# EAGLE design DSO150_Conversion_Board_1.0 (EAGLE 8.6.0)
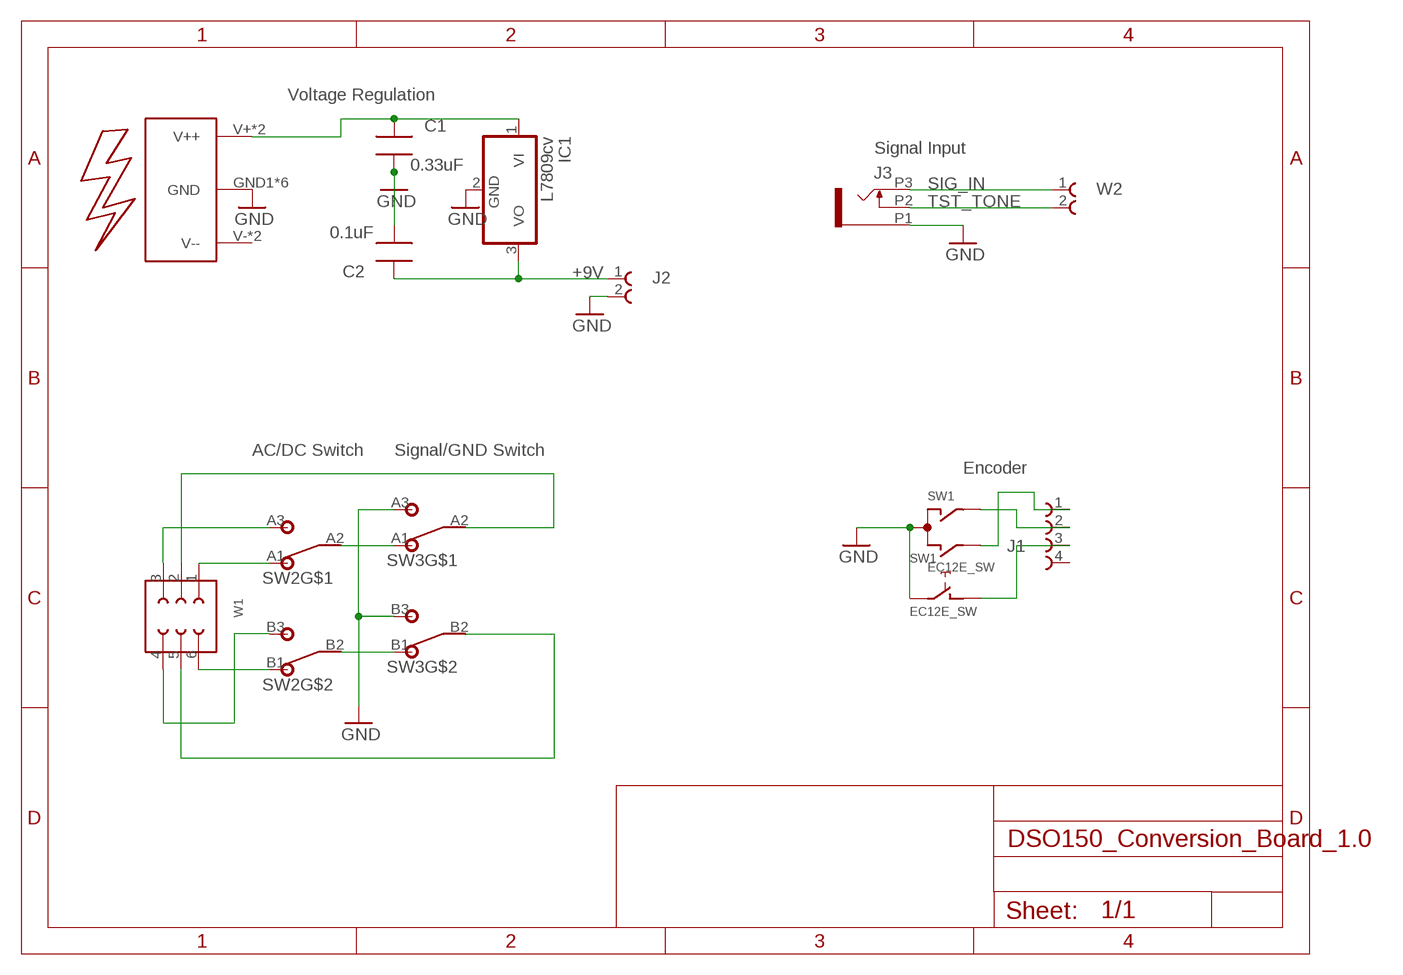
[diagram p0: schematic, sheet 1]

## Parts
C1  0.33uF  CAPACITOR-C2.5-4  [C2.5-4]
C2  0.1uF  CAPACITOR-C2.5-4  [C2.5-4]
IC1  L7809cv  7808T  [TO220H]
J1  61300411121  [61300411121]
J2  61300211121  [61300211121]
J3  OG-PJ301_PJ301_THONKICONN7  [OG-PJ301_WQP_PJ_301M7]
SW1  EC12E_SW  [ALPS_EC12E_SW]
SW2  SUBDPDT  [SUBMINIDPDT]
SW3  SUBDPDT  [SUBMINIDPDT]
U$2  EURO_POWER2  [EURO_POWER2]
W1  61300621121  [61300621121]
W2  61300211121  [61300211121]

## Nets
+9V: C2.1 IC1.3(VO) J2.1
+12V: C1.1 IC1.1(VI) U$2.V+(V++) U$2.V++
GND: C1.2 C2.2 IC1.2(GND) J2.2 J3.P1 SW1.C SW1.E SW3.A3 SW3.B3 U$2.GND1(GND) U$2.GND2(GND) U$2.GND3(GND) U$2.GND4(GND) U$2.GND5(GND) U$2.GND6(GND)
N$1: J1.2 SW1.A
N$2: J1.1 SW1.B
N$3: J1.3 SW1.D
N$6: SW2.A1 W1.1
N$7: SW2.B1 W1.6
N$8: SW2.B2 SW3.B1
N$9: SW2.A2 SW3.A1
N$11: SW2.A3 W1.3
N$12: SW2.B3 W1.4
N$13: SW3.A2 W1.2
N$14: SW3.B2 W1.5
SIG_IN: J3.P3 W2.1
TST_TONE: J3.P2 W2.2
Unconnected: J1.4 SW1.GND1(G) SW1.GND2(G) U$2.V-(V--) U$2.V--

## Notes on the sheet
- Voltage Regulation
- Signal Input
- AC/DC Switch | Signal/GND Switch
- Encoder

## Library data of the parts
C1 C2 = tsyklon-labs:CAPACITOR: POLARIZED CAPACITOR, American symbol Horizontal Mounting
IC1 = linear:78*: Positive VOLTAGE REGULATOR Source: http://cache.national.com/ds/LM/LM78L05.pdf http://www.fairchildsemi.com/ds/LM/LM7805.pdf
J1 = Wurth_Elektronik_Electromechanic_Board_to_Board_Connectors_rev17a:61300411121: WR-PHD 2.54mm Pin Header, 4 Pin =>Code : Con_BTB_PHD_2.54_1_THT_61300411121 <http://katalog.we-online.de/media/images/eican/Con_BTB_PHD_2.54_1_THT_6130xx11121_pf2.jpg> Details see: http://katalog.we-online.de/en/em/613_0xx_111_21 Created 2014-05-29, Karrer Zheng 2014 (C) Würth Elektronik
J2 W2 = Wurth_Elektronik_Electromechanic_Board_to_Board_Connectors_rev17a:61300211121: WR-PHD 2.54mm Pin Header, 2 Pin=>Code : Con_BTB_PHD_2.54_1_THT_61300211121 <http://katalog.we-online.de/media/images/eican/Con_BTB_PHD_2.54_1_THT_6130xx11121_pf2.jpg> Details see: http://katalog.we-online.de/en/em/613_0xx_111_21 Created 2014-05-29, Karrer Zheng 2014 (C) Würth Elektronik
J3 = elements_v02:OG-PJ301_PJ301_THONKICONN
SW1 = switch-alps:EC12E_SW: ALPS rotary Encoder EC12E series with switch; MPN: EC12E2424407; OC_FARNELL: 1520813; OC_NEWARK: 74M1068
SW2 SW3 = Sub-Miniature-switch:SUBDPDT
U$2 = INSTRUO:EURO_POWER2
W1 = Wurth_Elektronik_Electromechanic_Board_to_Board_Connectors_rev17a:61300621121: WR-PHD 2.54mm Dual Pin Header, 6 Pins =>Code : Con_BTB_PHD_2.54_2_61300621121 <http://katalog.we-online.de/media/images/eican/Con_BTB_PHD_2.54_2_6130xx21121_pf2.jpg> Details see: http://katalog.we-online.de/en/em/613_0xx_211_21 Created 2014-05-29, Karrer Zheng 2014 (C) Würth Elektronik

## Board
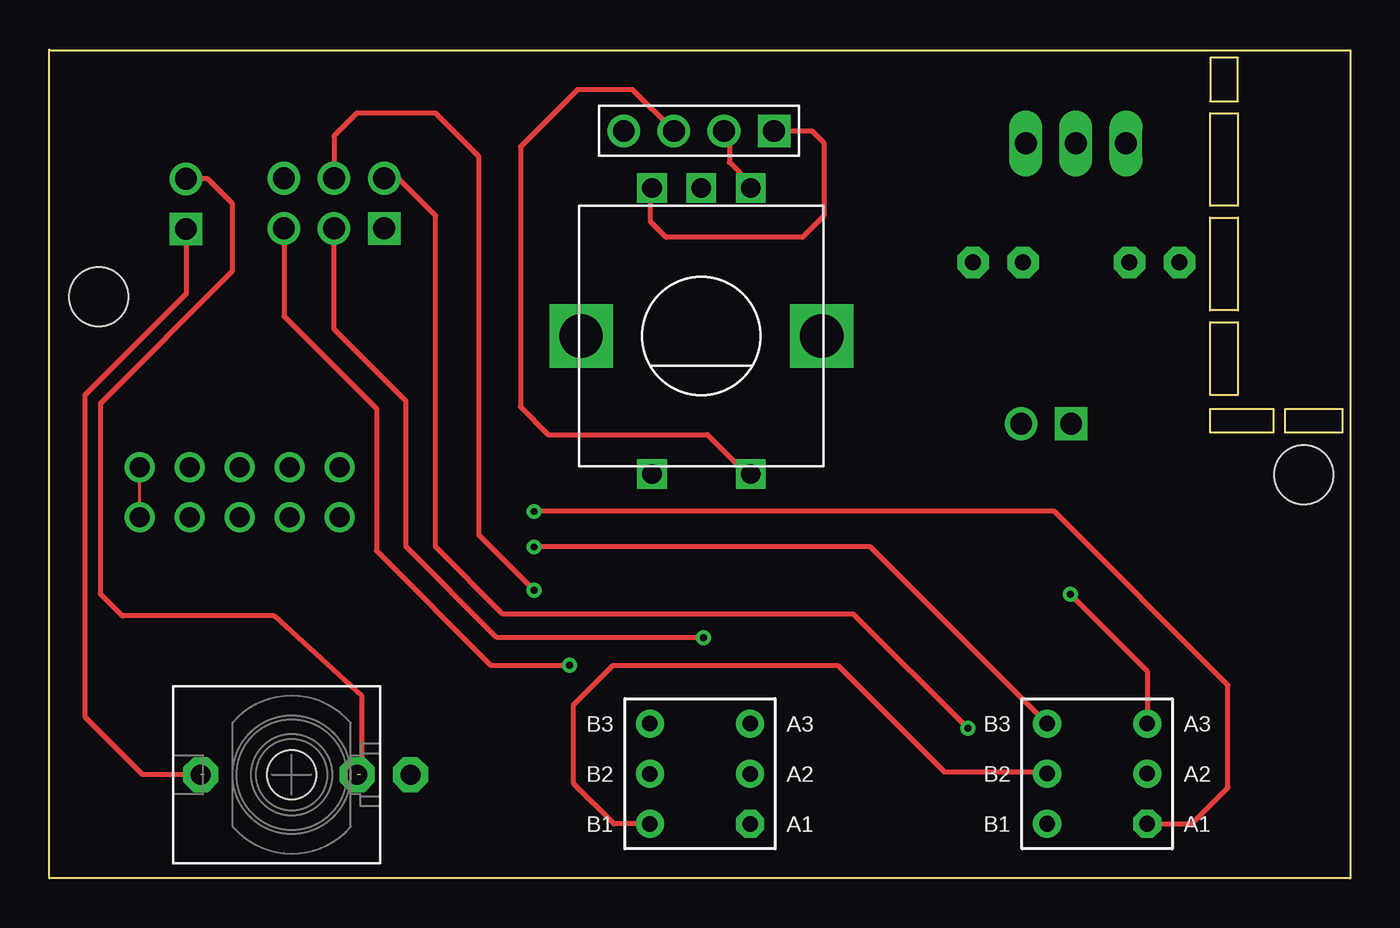
[diagram p1: board, top side]
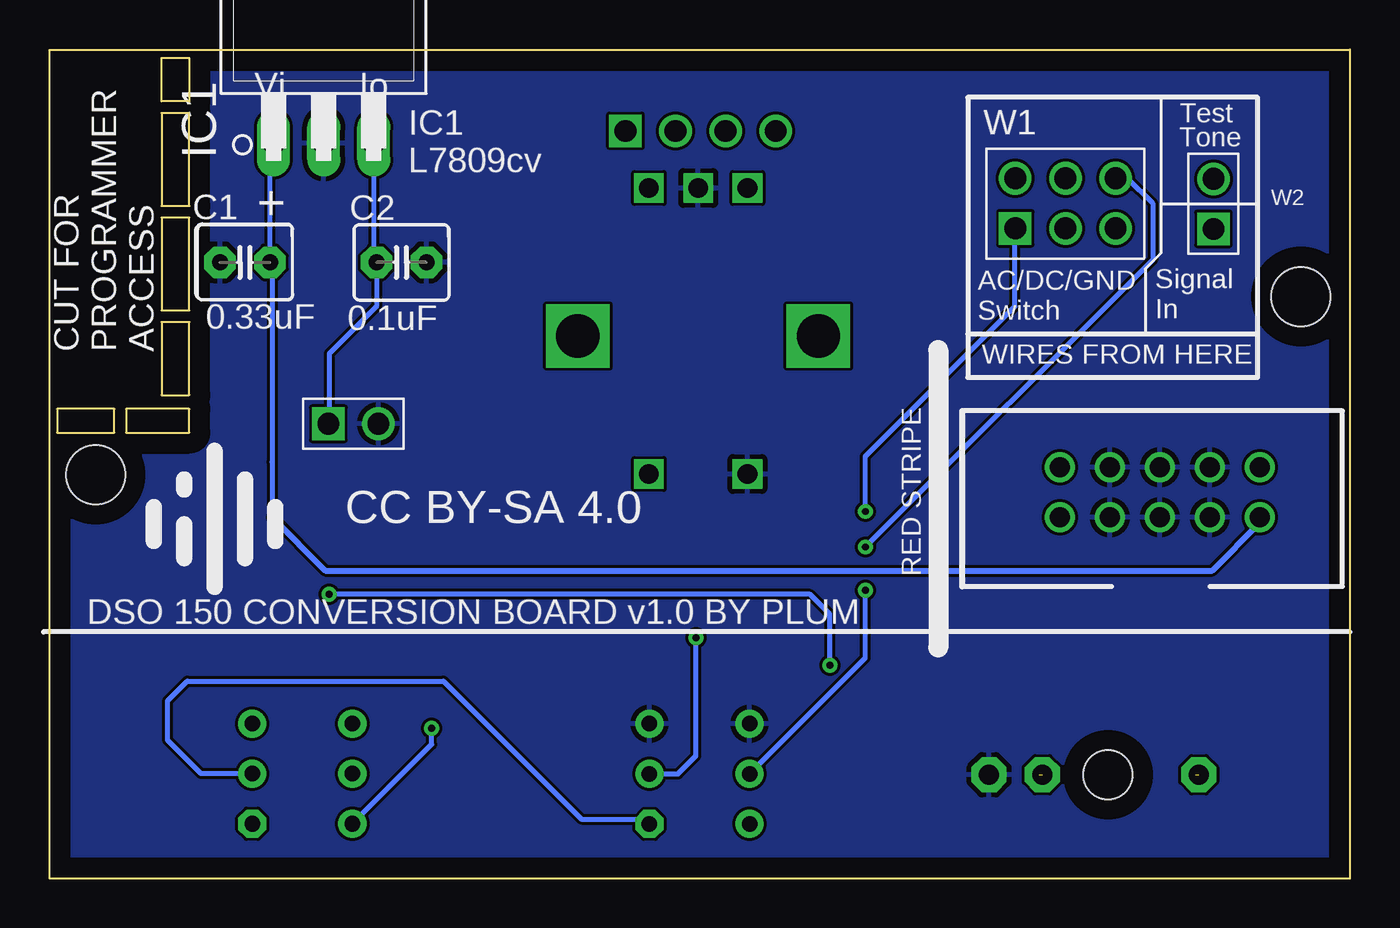
[diagram p2: board, bottom side, seen from below]

Size 66 x 42.04 mm. Coordinates in mm from the lower left corner, seen from the top.
Outline: 0,42 0,0 66,0 66,42 0,42
Outline: 0,42 0,42.04
Outline: 65.6,22.6 62.7,22.6 62.7,23.8 65.6,23.8 65.6,22.6
Outline: 62.1,22.6 58.9,22.6 58.9,23.8 62.1,23.8 62.1,22.6
Outline: 58.9,24.5 58.9,28.2 60.3,28.2 60.3,24.5 58.9,24.5
Outline: 58.9,28.8 58.9,33.5 60.3,33.5 60.3,28.8 58.9,28.8
Outline: 58.9,34.1 58.9,38.8 60.3,38.8 60.3,34.1 58.9,34.1
Outline: 58.9,39.4 60.3,39.4 60.3,41.6 58.9,41.6 58.9,39.4
Copper layers (1*16): Top 0.035mm / dielectric 1.5mm / Bottom 0.035mm
Design rules "default *": minimum track width 6mil, minimum drill 0.3mm, track to track 6mil, track to pad 6mil, pad to pad 6mil, via to via 6mil, smd to smd 6mil, copper to edge 40mil, drill to drill 6mil, minimum pad ring 10mil, minimum via ring 8mil, stop-mask expansion 4mil, vias tented up to drill 0mil, thermal gap 10mil
Holes 3 mm at 2.5,29.5 63.64,20.46

### Footprints (pad centres in the part's own frame; a part is rotated, then mirrored left to right if it is on the bottom)
C2.5-4 = drill 0.813 pad 1.6 octagon: 1 -1.27,0; 2 1.27,0
TO220H = drill 1.118 long: 1 -2.54,-10.16; 2 0,-10.16; 3 2.54,-10.16
61300411121 = drill 1.1 square: 1 -3.81,0 | drill 1.1: 2 -1.27,0; 3 1.27,0; 4 3.81,0
61300211121 = drill 1.1 square: 1 -1.27,0 | drill 1.1: 2 1.27,0
OG-PJ301_WQP_PJ_301M7 = drill 1.016 pad 1.778 octagon: P1 0,-6.032; P2 0,-3.334; P3 0,4.604 | hole 2.5: 0,0
ALPS_EC12E_SW = drill 1 square: A -2.5,-7.5; B 2.5,-7.5; C 0,-7.5; D -2.5,7; E 2.5,7 | drill 2.2 square: GND1 -6.1,0; GND2 6.1,0
SUBMINIDPDT = drill 0.787 pad 1.422 octagon: A1 -2.54,2.54 | drill 0.787 pad 1.422: A2 -2.54,0; A3 -2.54,-2.54; B1 2.54,2.54; B2 2.54,0; B3 2.54,-2.54
EURO_POWER2 = drill 1.016: GND1 -1.27,2.54; GND2 1.27,2.54; GND3 -1.27,0; GND4 1.27,0; GND5 -1.27,-2.54; GND6 1.27,-2.54; V+ -1.27,5.08; V++ 1.27,5.08; V- -1.27,-5.08; V-- 1.27,-5.08
61300621121 = drill 1.1 square: 1 -2.54,-1.27 | drill 1.1: 2 0,-1.27; 3 2.54,-1.27; 4 2.54,1.27; 5 0,1.27; 6 -2.54,1.27

### Placement (x,y rotation side)
C1  56.07,31.23 180 bottom
C2  48.13,31.23 0 bottom
IC1  52.08,47.43 0 bottom
J1  32.96,37.9 180 top
J2  50.57,23.05 0 bottom
J3  12.29,5.25 90 top
SW1  33.08,27.5 180 top
SW2  53.16,5.3 180 top
SW3  33.01,5.3 180 top
U$1  [LOG_TSILK]  57.6,18.3 0 top
U$2  9.66,19.57 270 bottom
U$3  [LOGO_BSILK]  57.6,18.4 0 top
W1  14.45,34.23 0 bottom
W2  6.94,34.2 90 bottom

### Tracks (layer width: path | path; a pad name or v marks a point on that pad's centre or on a via)
+9V
  Bottom 0.254: IC1.3 49.54,31.37 C2.1 49.4,29 51.8,26.6 51.8,23.09 J2.1
+12V
  Top 0.152: U$2.V++ U$2.V+
  Bottom 0.254: 54.7,18.3 54.7,21.1 54.7,31.13 C1.1 54.8,37.09 IC1.1
  Bottom 0.305: 54.7,18.3 52,15.6 7,15.6 4.58,18.02 U$2.V++
GND
  pour Bottom: 0.1,42 66.3,42 66.3,0.2 0,0.2
N$1
  Top 0.254: J1.2 34.5,37.63 34.5,36.3 35.58,35.22 SW1.A
N$2
  Top 0.254: J1.1 38.7,37.9 39.3,37.3 39.3,33.6 38.2,32.5 31.3,32.5 30.5,33.3 30.5,34.92 SW1.B
N$3
  Top 0.254: J1.3 29.59,40 26.8,40 23.9,37.1 23.9,23.9 25.3,22.5 33.4,22.5 35.4,20.5 SW1.D
N$6  (via drill 0.35)
  Top 0.254: SW2.A1 57.96,2.76 59.8,4.6 59.8,9.8 51,18.6 v24.6,18.6
  Bottom 0.254: v24.6,18.6 24.6,21.4 17,29 W1.1
N$7  (via drill 0.35)
  Top 0.254: v46.6,7.6 40.8,13.4 23,13.4 19.6,16.8 19.6,33.6 17.7,35.5 W1.6
  Bottom 0.254: SW2.B1 46.6,6.79 v46.6,7.6
N$8
  Top 0.254: SW3.B1 28.64,2.76 26.6,4.8 26.6,8.8 28.6,10.8 40,10.8 45.4,5.4 50.53,5.4 SW2.B2
N$9
  Bottom 0.254: SW2.A2 58.3,5.3 60,7 60,9 59,10 46,10 39,3 35.79,3 SW3.A1
N$11  (via drill 0.35)
  Top 0.254: W1.3 11.91,28.49 16.6,23.8 16.6,16.6 22.4,10.8 v26.4,10.8 | v51.8,14.4 55.7,10.5 SW2.A3
  Bottom 0.254: v26.4,10.8 26.4,13.4 27.4,14.4 v51.8,14.4
N$12  (via drill 0.35)
  Top 0.254: SW2.B3 41.67,16.8 v24.6,16.8
  Bottom 0.254: v24.6,16.8 10,31.4 10,34.2 11.3,35.5 W1.4
N$13  (via drill 0.35)
  Top 0.254: W1.2 14.45,27.85 18.1,24.2 18.1,16.8 22.7,12.2 v33.2,12.2
  Bottom 0.254: SW3.A2 34.1,5.3 33.2,6.2 v33.2,12.2
N$14  (via drill 0.35)
  Top 0.254: W1.5 14.45,37.65 15.6,38.8 19.6,38.8 21.8,36.6 21.8,17.4 v24.6,14.6
  Bottom 0.254: SW3.B2 24.6,11.17 v24.6,14.6
SIG_IN  (1 unrouted)
  Top 0.152: 7.29,5.25 7.3,5.25
  Top 0.254: 7.85,5.25 7.3,5.25 4.75,5.25 1.8,8.2 1.8,24.5 6.94,29.64 W2.1
  Top 0.305: 6.9,32.89 W2.1
TST_TONE  (1 unrouted)
  Top 0.152: 15.79,5.25 15.87,5.25
  Top 0.254: 15.87,5.25 15.87,9.23 11.4,13.3 3.7,13.3 2.6,14.4 2.6,24.1 9.3,30.8 9.3,34.2 8.03,35.47 W2.2

### Text on the board
_tsilk: CUT FOR / PROGRAMMER / ACCESS | - | + | 9V Power | Signal In | SIG/GND | AC/DC
_bsilk: Io | Vi | Test / Tone | IC1 / L7809cv | + | Signal / In | AC/DC/GND / Switch | CUT FOR / PROGRAMMER / ACCESS | WIRES FROM HERE | RED STRIPE | CC BY-SA 4.0 | DSO 150 CONVERSION BOARD v1.0 BY PLUM